# Altium schematic sheet [04] - MICRO.SchDoc
size A3; DocumentNumber: 4; SheetNumber: 4; SheetTotal: 5
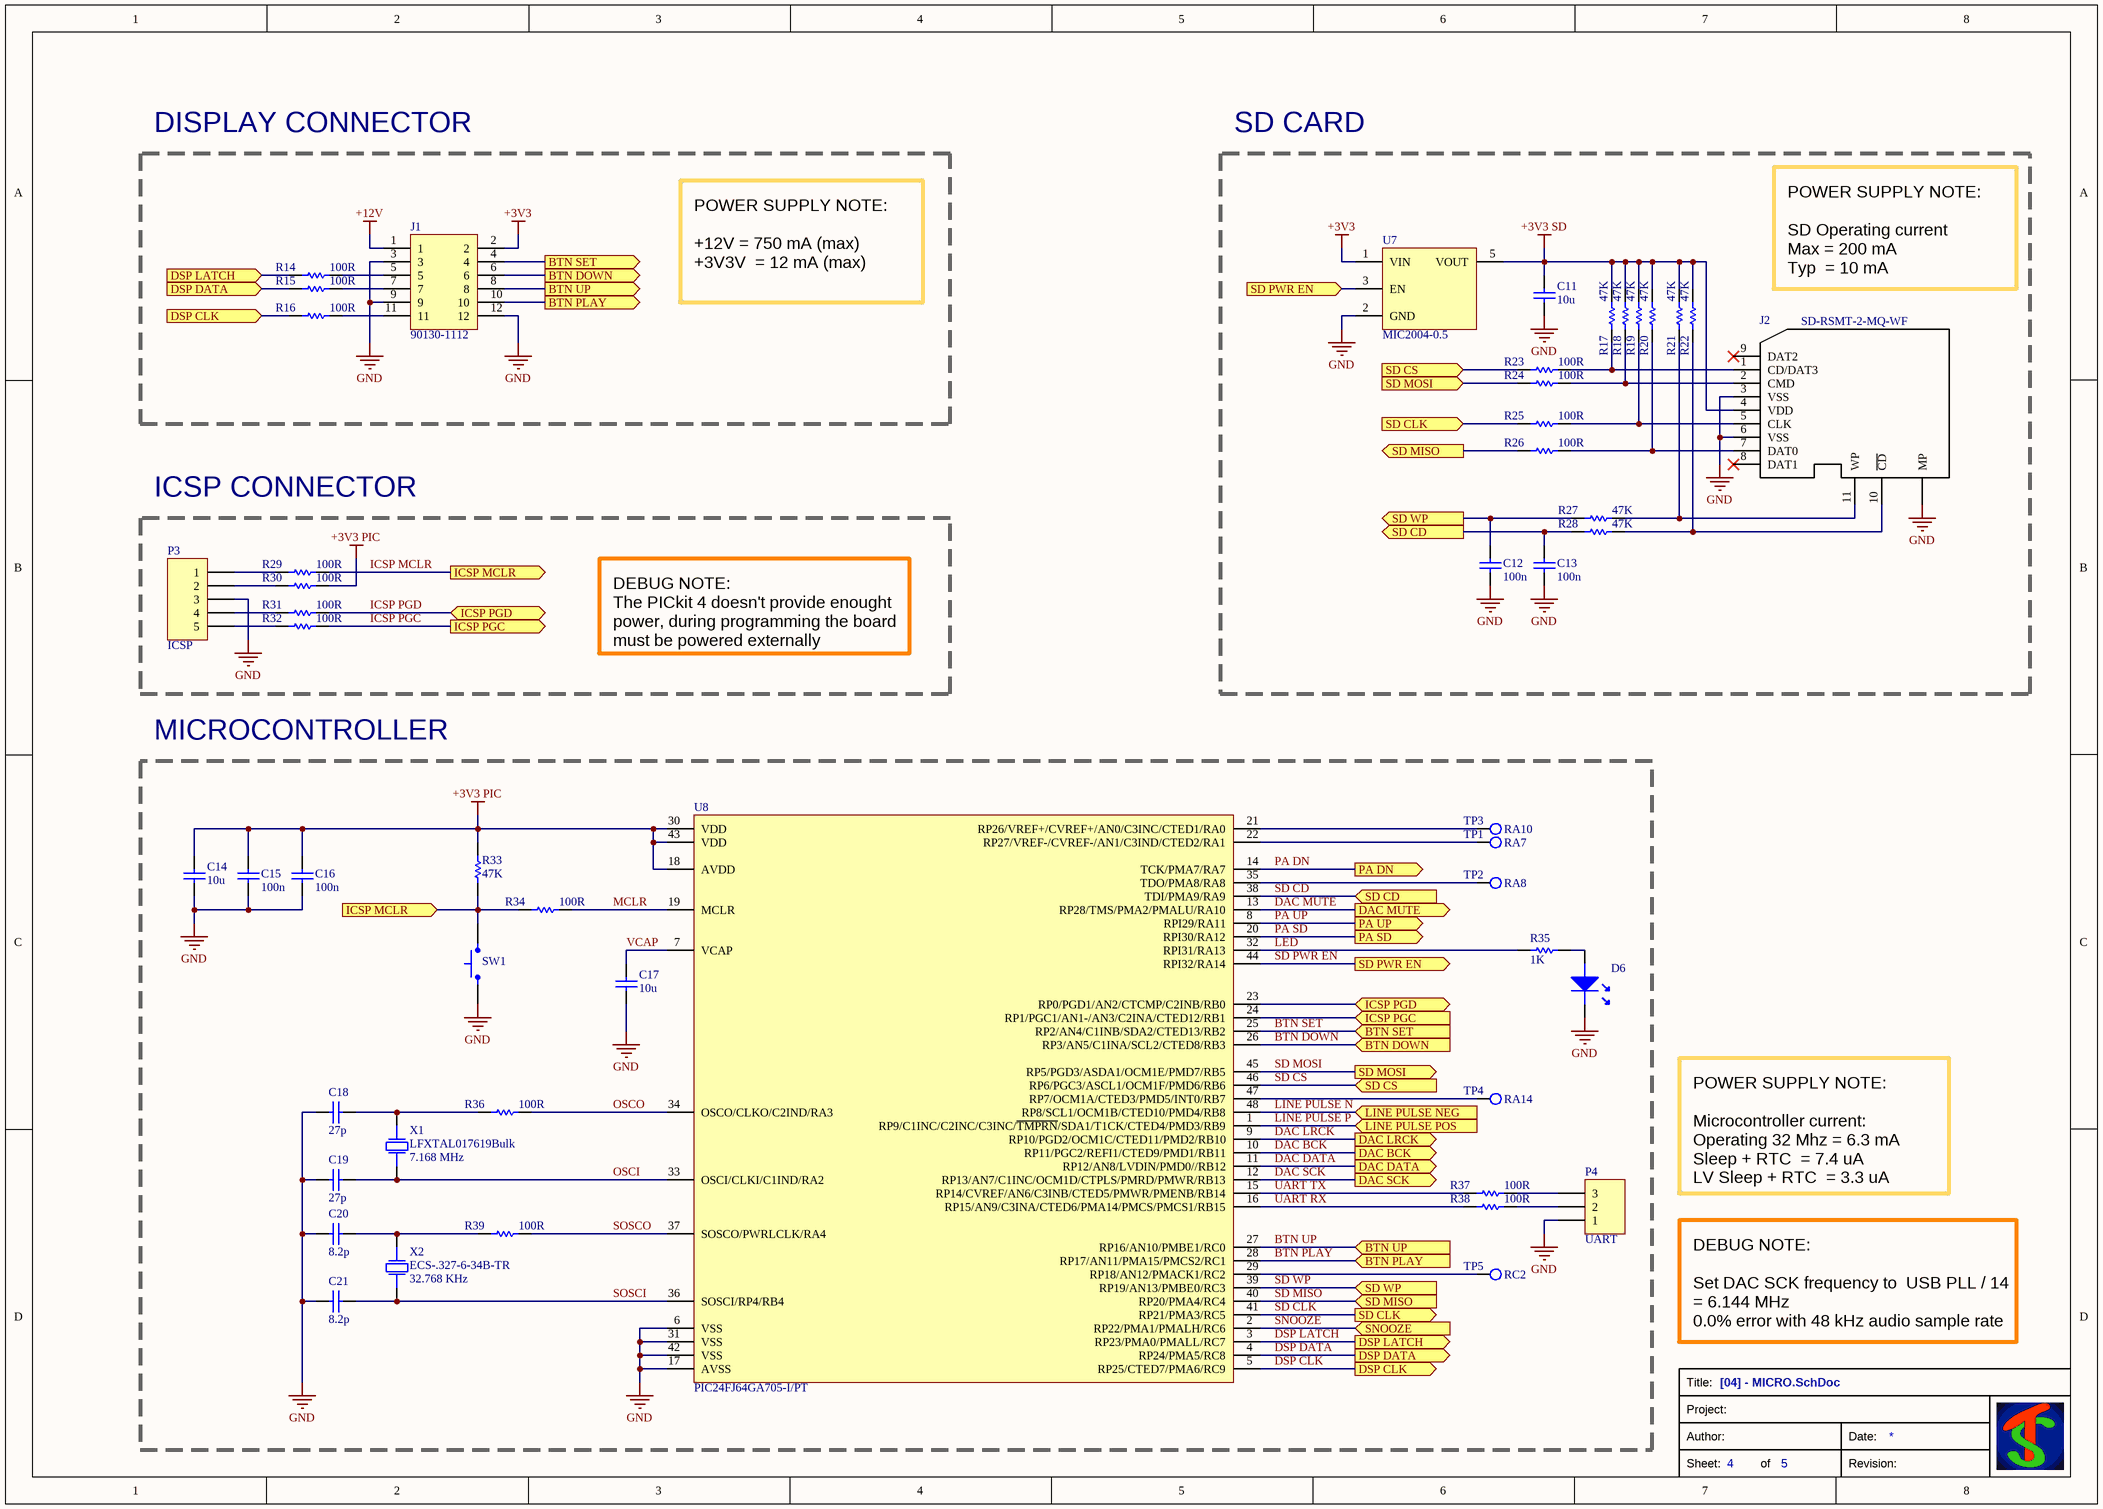
[diagram p0: [04] - MICRO.SchDoc]

## Parts
C11  value 10u  [CAP-0805]  (hidden comment: CL21A106KAYNNN)
C12  value 100n  [CAP-0603]  (hidden comment: C0603C104M4RAC)
C13  value 100n  [CAP-0603]  (hidden comment: C0603C104M4RAC)
C14  value 10u  [CAP-0805]  (hidden comment: CL21A106KAYNNN)
C15  value 100n  [CAP-0603]  (hidden comment: C0603C104M4RAC)
C16  value 100n  [CAP-0603]  (hidden comment: C0603C104M4RAC)
C17  value 10u  [CAP-0805]  (hidden comment: CL21A106KAYNNN)
C18  value 27p  [CAP-0603]  (hidden comment: C0603C270J5GACTU)
C19  value 27p  [CAP-0603]  (hidden comment: C0603C270J5GACTU)
C20  value 8.2p  [CAP-0603]  (hidden comment: CC0603JRNPO9BN8R2)
C21  value 8.2p  [CAP-0603]  (hidden comment: CC0603JRNPO9BN8R2)
D6  150060VS75000  [LED-SMD-0603-1.6X0.8]  (value not drawn)
J1  90130-1112  [SHDR12W65P254_2X6_1758X975X1110P]
J2  SD-RSMT-2-MQ-WF  [SD 3M SD-RSMT-2-MQ-WF]
P3  ICSP  [HDR1X5]
P4  UART  [HDR1X3]
R14  value 100R  [RES-0603]  (hidden comment: RC0603FR-07100RL)
R15  value 100R  [RES-0603]  (hidden comment: RC0603FR-07100RL)
R16  value 100R  [RES-0603]  (hidden comment: RC0603FR-07100RL)
R17  value 47K  [RES-0603]  (hidden comment: RC0603FR-0747KL)
R18  value 47K  [RES-0603]  (hidden comment: RC0603FR-0747KL)
R19  value 47K  [RES-0603]  (hidden comment: RC0603FR-0747KL)
R20  value 47K  [RES-0603]  (hidden comment: RC0603FR-0747KL)
R21  value 47K  [RES-0603]  (hidden comment: RC0603FR-0747KL)
R22  value 47K  [RES-0603]  (hidden comment: RC0603FR-0747KL)
R23  value 100R  [RES-0603]  (hidden comment: RC0603FR-07100RL)
R24  value 100R  [RES-0603]  (hidden comment: RC0603FR-07100RL)
R25  value 100R  [RES-0603]  (hidden comment: RC0603FR-07100RL)
R26  value 100R  [RES-0603]  (hidden comment: RC0603FR-07100RL)
R27  value 47K  [RES-0603]  (hidden comment: RC0603FR-0747KL)
R28  value 47K  [RES-0603]  (hidden comment: RC0603FR-0747KL)
R29  value 100R  [RES-0603]  (hidden comment: RC0603FR-07100RL)
R30  value 100R  [RES-0603]  (hidden comment: RC0603FR-07100RL)
R31  value 100R  [RES-0603]  (hidden comment: RC0603FR-07100RL)
R32  value 100R  [RES-0603]  (hidden comment: RC0603FR-07100RL)
R33  value 47K  [RES-0603]  (hidden comment: RC0603FR-0747KL)
R34  value 100R  [RES-0603]  (hidden comment: RC0603FR-07100RL)
R35  value 1K  [RES-0603]  (hidden comment: RC0603FR-071KL)
R36  value 100R  [RES-0603]  (hidden comment: RC0603FR-07100RL)
R37  value 100R  [RES-0603]  (hidden comment: RC0603FR-07100RL)
R38  value 100R  [RES-0603]  (hidden comment: RC0603FR-07100RL)
R39  value 100R  [RES-0603]  (hidden comment: RC0603FR-07100RL)
SW1  Push Button 6mm TH  [Push Button 6mm TH]  (value not drawn)
TP1  RA7  [TESTPOINT-1mm]  (no BOM)
TP2  RA8  [TESTPOINT-1mm]  (no BOM)
TP3  RA10  [TESTPOINT-1mm]  (no BOM)
TP4  RA14  [TESTPOINT-1mm]  (no BOM)
TP5  RC2  [TESTPOINT-1mm]  (no BOM)
U7  MIC2004-0.5  [SOT23-5]
U8  PIC24FJ64GA705-I/PT  [TSQFP50P900X900X120-48N]
X1  LFXTAL017619Bulk  value 7.168 MHz  [XTAL1140X490X430_HC49]
X2  ECS-.327-6-34B-TR  value 32.768 KHz  [XTAL-ECS-3.2 mm x 1.5 mm]

## Blocks framed on the sheet
DISPLAY CONNECTOR: J1 R14-R16
SD CARD: C11-C13 J2 R17-R28 U7
ICSP CONNECTOR: P3 R29-R32
MICROCONTROLLER: C14-C21 D6 P4 R33-R39 SW1 TP1-TP5 U8 X1 X2

## Ports
BTN DOWN (in), BTN DOWN (out), BTN PLAY (in), BTN PLAY (out), BTN SET (in), BTN SET (out), BTN UP (in), BTN UP (out), DAC BCK (out), DAC DATA (out), DAC LRCK (out), DAC MUTE (out), DAC SCK (out), DSP CLK (in), DSP CLK (out), DSP DATA (in), DSP DATA (out), DSP LATCH (in), DSP LATCH (out), ICSP MCLR (in), ICSP MCLR (out), ICSP PGC (in), ICSP PGC (out), ICSP PGD (bidir), LINE PULSE NEG (in), LINE PULSE POS (in), PA DN (out), PA SD (out), PA UP (out), SD CD (in), SD CD (out), SD CLK (in), SD CLK (out), SD CS (in), SD MISO (in), SD MISO (out), SD MOSI (in), SD MOSI (out), SD PWR EN (in), SD PWR EN (out), SD WP (in), SD WP (out), SNOOZE (in)

## Nets
+3V3: J1.2 U7.1(VIN)
+3V3 PIC: C14.1 C15.2 C16.2 R30.2 R33.2 U8.18(AVDD) U8.30(VDD) U8.43(VDD)
+3V3 SD: C11.1 J2.4(VDD) R17.2 R18.2 R19.2 R20.2 R21.2 R22.2 U7.5(VOUT)
+12V: J1.1
GND: C11.2 C12.1 C13.1 C14.2 C15.1 C16.1 C17.2 C18.2 C19.2 C20.2 C21.2 D6.K J1.3 J1.9 J1.12 J2.3(VSS) J2.6(VSS) J2.MP P3.3 P4.1 SW1.1 U7.2(GND) U8.6(VSS) U8.17(AVSS) U8.31(VSS) U8.42(VSS)
BTN DOWN: J1.6 U8.26(RP3/AN5/C1INA/SCL2/CTED8/RB3) ; port BTN DOWN
BTN PLAY: J1.10 U8.28(RP17/AN11/PMA15/PMCS2/RC1) ; port BTN PLAY
BTN SET: J1.4 U8.25(RP2/AN4/C1INB/SDA2/CTED13/RB2) ; port BTN SET
BTN UP: J1.8 U8.27(RP16/AN10/PMBE1/RC0) ; port BTN UP
DAC BCK: U8.10(RP11/PGC2/REFI1/CTED9/PMD1/RB11) ; port DAC BCK
DAC DATA: U8.11(RP12/AN8/LVDIN/PMD0//RB12) ; port DAC DATA
DAC LRCK: U8.9(RP10/PGD2/OCM1C/CTED11/PMD2/RB10) ; port DAC LRCK
DAC MUTE: U8.13(RP28/TMS/PMA2/PMALU/RA10) ; port DAC MUTE
DAC SCK: U8.12(RP13/AN7/C1INC/OCM1D/CTPLS/PMRD/PMWR/RB13) ; port DAC SCK
DSP CLK: R16.1 U8.5(RP25/CTED7/PMA6/RC9) ; port DSP CLK
DSP DATA: R15.1 U8.4(RP24/PMA5/RC8) ; port DSP DATA
DSP LATCH: R14.1 U8.3(RP23/PMA0/PMALL/RC7) ; port DSP LATCH
ICSP MCLR: R29.2 R33.1 R34.1 SW1.2 ; port ICSP MCLR
ICSP PGC: R32.2 U8.24(RP1/PGC1/AN1-/AN3/C2INA/CTED12/RB1) ; port ICSP PGC
ICSP PGD: R31.2 U8.23(RP0/PGD1/AN2/CTCMP/C2INB/RB0) ; port ICSP PGD
LED: R35.1 U8.32(RPI31/RA13)
LINE PULSE N: U8.48(RP8/SCL1/OCM1B/CTED10/PMD4/RB8) ; port LINE PULSE NEG
LINE PULSE P: U8.1(RP9/C1INC/C2INC/C3INC/~{TMPRN}/SDA1/T1CK/CTED4/PMD3/RB9) ; port LINE PULSE POS
MCLR: R34.2 U8.19(MCLR)
OSCI: C19.1 U8.33(OSCI/CLKI/C1IND/RA2) X1.1
OSCO: R36.2 U8.34(OSCO/CLKO/C2IND/RA3)
PA DN: U8.14(TCK/PMA7/RA7) ; port PA DN
PA SD: U8.20(RPI30/RA12) ; port PA SD
PA UP: U8.8(RPI29/RA11) ; port PA UP
SD CD: C13.2 R28.1 U8.38(TDI/PMA9/RA9) ; port SD CD
SD CLK: R25.1 U8.41(RP21/PMA3/RC5) ; port SD CLK
SD CS: R23.1 U8.46(RP6/PGC3/ASCL1/OCM1F/PMD6/RB6) ; port SD CS
SD MISO: R26.1 U8.40(RP20/PMA4/RC4) ; port SD MISO
SD MOSI: R24.1 U8.45(RP5/PGD3/ASDA1/OCM1E/PMD7/RB5) ; port SD MOSI
SD PWR EN: U7.3(EN) U8.44(RPI32/RA14) ; port SD PWR EN
SD WP: C12.2 R27.1 U8.39(RP19/AN13/PMBE0/RC3) ; port SD WP
SNOOZE: U8.2(RP22/PMA1/PMALH/RC6) ; port SNOOZE
SOSCI: C21.1 U8.36(SOSCI/RP4/RB4) X2.1
SOSCO: R39.2 U8.37(SOSCO/PWRLCLK/RA4)
UART RX: R38.1 U8.16(RP15/AN9/C3INA/CTED6/PMA14/PMCS/PMCS1/RB15)
UART TX: R37.1 U8.15(RP14/CVREF/AN6/C3INB/CTED5/PMWR/PMENB/RB14)
VCAP: C17.1 U8.7(VCAP)
NetC18_1: C18.1 R36.1 X1.2
NetC20_1: C20.1 R39.1 X2.2
NetD6_A: D6.A R35.2
NetJ1_5: J1.5 R14.2
NetJ1_7: J1.7 R15.2
NetJ1_11: J1.11 R16.2
NetJ2_1: J2.1(CD/DAT3) R17.1 R23.2
NetJ2_2: J2.2(CMD) R18.1 R24.2
NetJ2_5: J2.5(CLK) R19.1 R25.2
NetJ2_7: J2.7(DAT0) R20.1 R26.2
NetJ2_10: J2.10(~{CD}) R22.1 R28.2
NetJ2_11: J2.11(WP) R21.1 R27.2
NetP3_1: P3.1 R29.1
NetP3_2: P3.2 R30.1
NetP3_4: P3.4 R31.1
NetP3_5: P3.5 R32.1
NetP4_2: P4.2 R38.2
NetP4_3: P4.3 R37.2
NetTP1_1: TP1.1 U8.22(RP27/VREF-/CVREF-/AN1/C3IND/CTED2/RA1)
NetTP2_1: TP2.1 U8.35(TDO/PMA8/RA8)
NetTP3_1: TP3.1 U8.21(RP26/VREF+/CVREF+/AN0/C3INC/CTED1/RA0)
NetTP4_1: TP4.1 U8.47(RP7/OCM1A/CTED3/PMD5/INT0/RB7)
NetTP5_1: TP5.1 U8.29(RP18/AN12/PMACK1/RC2)

Not connected (* = marked no-connect by the designer): J2 8(DAT1)* 9(DAT2)*

## Notes on the sheet
- POWER SUPPLY NOTE:
  +12V	= 750 mA (max)
  +3V3V 	= 12 mA (max)
- POWER SUPPLY NOTE:
  SD Operating current
  Max	= 200 mA
  Typ 	= 10 mA
- DEBUG NOTE:
  The PICkit 4 doesn't provide enought power, during programming the board must be powered externally
- POWER SUPPLY NOTE:
  Microcontroller current:
  Operating 32 Mhz	= 6.3 mA
  Sleep + RTC 	= 7.4 uA
  LV Sleep + RTC 	= 3.3 uA
- DEBUG NOTE:
  Set DAC SCK frequency to  USB PLL / 14 = 6.144 MHz
  0.0% error with 48 kHz audio sample rate
- Title:
- Project:
- Sheet:
- Author:
- of
- Revision:
- Date:

## Library data of the parts
C11 C14 C17 = CAP-0805-10u-25V-X5R-10%: MLCC - SMD 25V 10uF X5R 10%; Manufacturer: Samsung; Voltage Rating: 25; Tolerance: 10%; Dielectric: X5R; Supplier 1: Mouser; Supplier Part Number 1: 187-CL21A106KAYNNNE
C12 C13 C15 C16 = CAP-0603-100n-16V-X7R-20%: MLCC - SMD 16V 100nF X7R 0603 20%; Manufacturer: KEMET; Tolerance: 20%; Dielectric: X7R; Supplier 1: Mouser; Supplier Part Number 1: 80-C0603C104M4RAC; Voltage Rating: 16V
C18 C19 = CAP-0603-27p-50V-NP0-5%: MLCC - SMD 50V 27pF NP0 0603 5%; Manufacturer: KEMET; Voltage Rating: 50V; Tolerance: 5%; Dielectric: NP0; Supplier 1: Mouser; Supplier Part Number 1: 80-C0603C270J5G
C20 C21 = CAP-0603-8p2-50V-NP0-5%: MLCC - SMD 50V 8.2pF NP0 0603 5%; Manufacturer: YAGEO; Voltage Rating: 50V; Tolerance: 5%; Dielectric: NP0; Supplier 1: Mouser; Supplier Part Number 1: 603-CC603JRNPO9BN8R2
D6 = LED-SMD-0603-Green-150060VS75000: Standard LEDs - SMD WL-SMCW SMDMono TpVw Waterclr 0603 BrtGrn; Manufacturer: Wurth Elektronik; Value: Green; Supplier 1: Mouser; Supplier Part Number 1: 710-150060VS75000
J1 = HEADER-12x2-2.54-TH-90130-1112: Terminali e capicorda 2.54MM CGRIDIII HDR 12P V DR SHRD TIN; Manufacturer_Name: Molex; Datasheet Link: https://www.molex.com/pdm_docs/sd/901301112_sd.pdf; Height: 11.1mm; Manufacturer_Part_Number: 90130-1112; Supplier 1: Mouser; Supplier Part Number 1: 538-90130-1112
J2 = SD-PUSH-PUSH-SD-RSMT-2-MQ-WF: Connettori per schede di memoria SD CARD CONNECTOR; Supplier 1: Mouser; Supplier Part Number 1: 517-SD-RSMT-2-MQ-WF
P3 = Header 5: Header, 5-Pin; LatestRevisionDate: 17-Jul-2002; LatestRevisionNote: Re-released for DXP Platform.; Publisher: Altium Limited
P4 = Header 3: Header, 3-Pin; LatestRevisionDate: 17-Jul-2002; LatestRevisionNote: Re-released for DXP Platform.; Publisher: Altium Limited
R14-R16 R23-R26 R29-R32 R34 R36-R39 = RES-0603-100R-1/10W-1%: Thick Film - SMD 75V 1/10W 100 ohm 0603 1%; Manufacturer: Yageo; Power Rating: 1/10W; Voltage Rating: 75V; Tolerance: 1%; Supplier 1: Mouser; Supplier Part Number 1: 603-RC0603FR-07100RL; Supplier 2: Mouser; Supplier 3: Mouser; Supplier Part Number 3: 603-RC0603FR-13100RL; Supplier Part Number 2: 603-RC0603FR-10100RL
R17-R22 R27 R28 R33 = RES-0603-47K-1/10W-1%: Thick Film - SMD 75V 1/10W 47K ohm 0603 1%; Manufacturer: Yageo; Power Rating: 1/10W; Voltage Rating: 75V; Tolerance: 1%; Supplier 1: Mouser; Supplier Part Number 1: 603-RC0603FR-0747KL; Supplier 2: Mouser; Supplier 3: Mouser; Supplier Part Number 3: 603-RC0603FR-1347KL; Supplier Part Number 2: 603-RC0603FR-1047KL
R35 = RES-0603-1K-1/10W-1%: Thick Film - SMD 75V 1/10W 1K ohm 0603 1%; Manufacturer: Yageo; Power Rating: 1/10W; Voltage Rating: 75V; Tolerance: 1%; Supplier 1: Mouser; Supplier 2: Mouser; Supplier 3: Mouser; Supplier Part Number 3: 603-RC0603FR-131KL; Supplier Part Number 2: 603-RC0603FR-101KL; Supplier Part Number 1: 603-RC0603FR-071KL
TP1-TP5 = TESTPOINT-SMD-1mm
U7 = MIC2004-0.5: Fixed 0.5A Current Limiting Power Distribution Switches; Supplier 1: Mouser; Supplier Part Number 1: 998-MIC2004-0.5YM5TR; Current Limit: 0.5A
U8 = PIC24FJ64GA705: Microcontrollori a 16 bit - MCU 16-bit, 16 MIPS, 64KB Flash, 16KB RAM; Supplier 1: Mouser; Supplier Part Number 1: 579-24FJ64GA705IPT
X1 = XTAL-SMD-7.168MHz: Crystal 7.168MHz 20ppm 30pF -10C +60C; Frequency Stability: 30 ppm; Drive Level: 500 uW; Load Capacitance: 30 pF; Frequency Tolerance: 20 ppm; Supplier 1: Mouser; Supplier Part Number 1: 449-LFXTAL017619BULK
X2 = XTAL-32.768KHz-ECS-.327-6-34B-TR: Crystal 32.768kHz 20ppm 6pF -40C +85C; Supplier 1: Mouser; Supplier Part Number 1: 520-.327-6-34BT; Load Capacitance: 6 pF